# Altium schematic sheet ESP32_FLASH_CARD_READER.SchDoc
size 381 x 381 mm; SheetNumber: 1; SheetTotal: 2
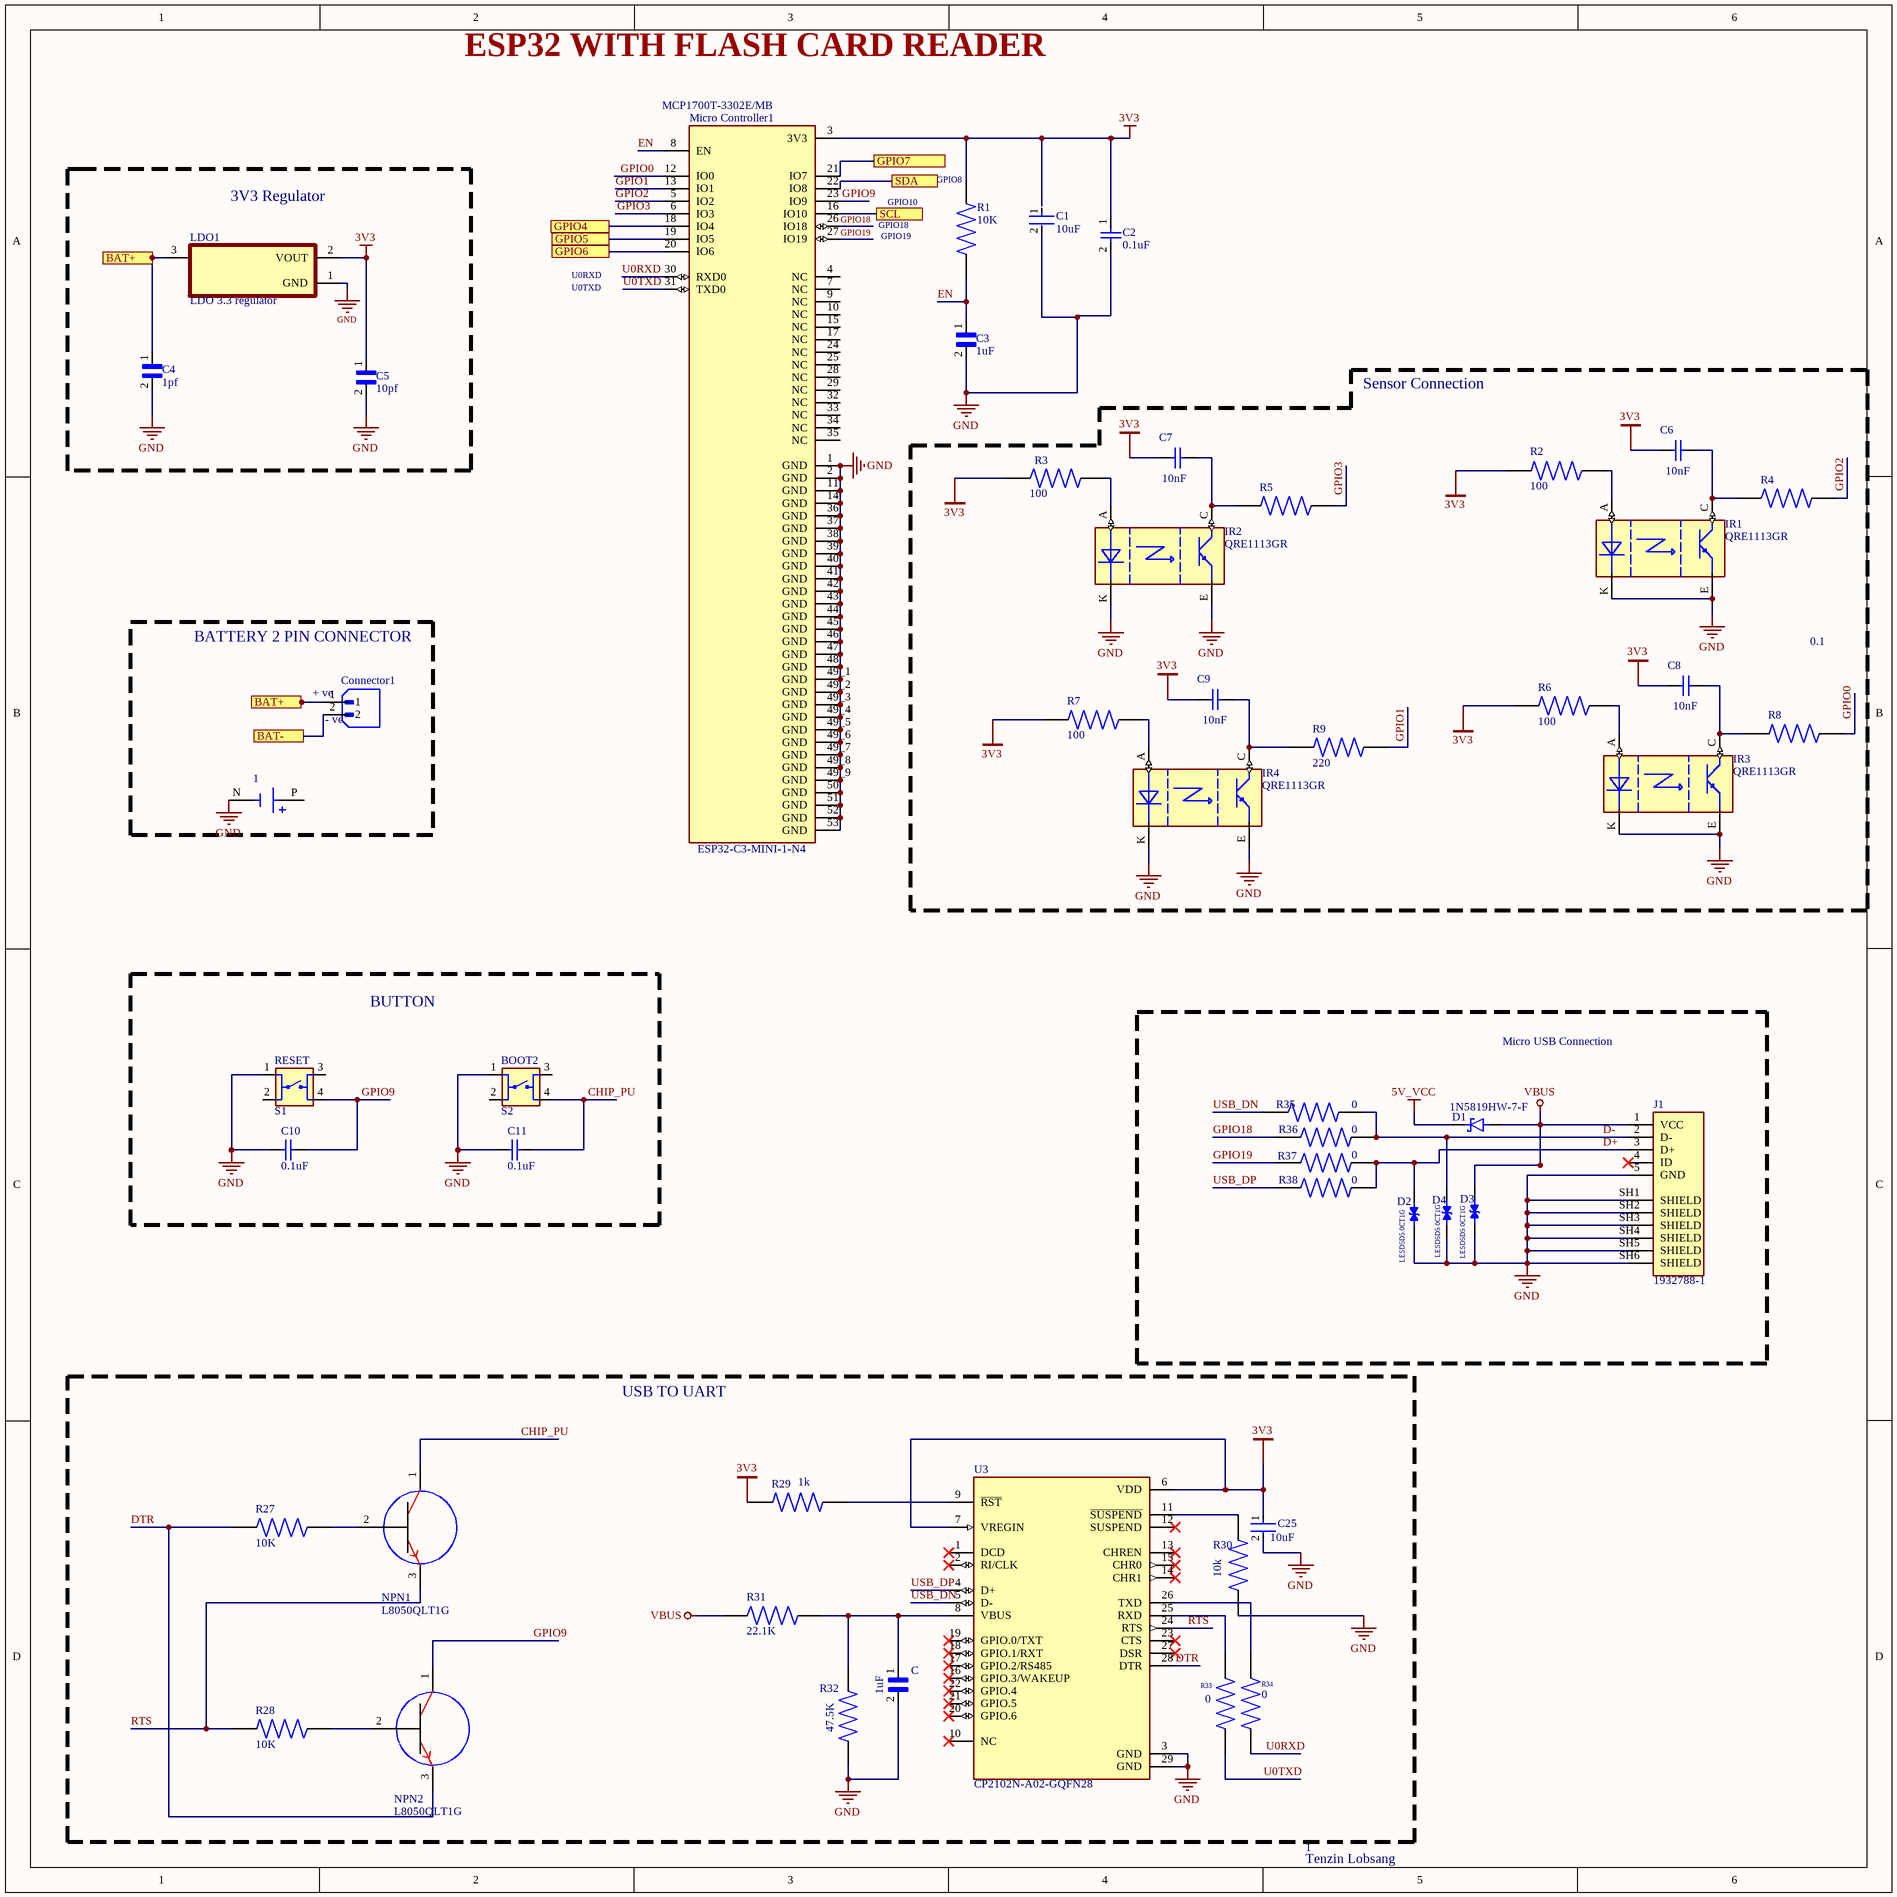
[diagram p0: ESP32_FLASH_CARD_READER.SchDoc]

## Parts
1  (no value)  [BAT_1043]
BOOT2  S2  [SW_4-1437565-2]
C  1uF  [CAPC1608X90N]
C1  10uF  [CAPC2012X88N]
C2  0.1uF  [CAPC1608X90X35NL10T15]
C3  1uF  [CAPC1608X90N]
C4  1pf  [CAPC2012X88N]
C5  10pf  [CAPC2012X88N]
C6  10nF  [WCAP-CSGP_0805_L2W1.25H1.25]
C7  10nF  [WCAP-CSGP_0805_L2W1.25H1.25]
C8  10nF  [WCAP-CSGP_0805_L2W1.25H1.25]
C9  10nF  [WCAP-CSGP_0805_L2W1.25H1.25]
C10  0.1uF  [CAPC1608X90X35NL10T15]
C11  0.1uF  [CAPC1608X90X35NL10T15]
C25  10uF  [CAPC2012X88N]
Connector1  B2B-XH-A  [JST_B2B-XH-A]  (value not drawn)
D1  1N5819HW-7-F  [SOD3715X145N]
D2  LESD5D5.0CT1G  [TVS_LESD5D5.0CT1G]
D3  LESD5D5.0CT1G  [TVS_LESD5D5.0CT1G]
D4  LESD5D5.0CT1G  [TVS_LESD5D5.0CT1G]
IR1  QRE1113GR  [4LEADSMD]
IR2  QRE1113GR  [4LEADSMD]
IR3  QRE1113GR  [4LEADSMD]
IR4  QRE1113GR  [4LEADSMD]
J1  1932788-1  [TE_1932788-1]
LDO1  LDO 3.3 regulator  [SOT95P237X112-3N]
Micro_Controller1  ESP32-C3-MINI-1-N4  Supplier Part Number 1: MCP1700T-3302E/MB  [XCVR_ESP32-C3-MINI-1-N4]
NPN1  L8050QLT1G  [SOT-23]
NPN2  L8050QLT1G  [SOT-23]
R1  10K  [RESC1005X40N]
R2  100  [RESC6432X75N]
R3  100  [RESC6432X75N]
R4  220  [RESC1005X35N]  (value not drawn)
R5  220  [RESC1005X35N]  (value not drawn)
R6  100  [RESC6432X75N]
R7  100  [RESC6432X75N]
R8  220  [RESC1005X35N]  (value not drawn)
R9  220  [RESC1005X35N]
R27  10K  [RESC1005X40N]
R28  10K  [RESC1005X40N]
R29  1k  [RES_ERJU06F1001V]
R30  10k  [RESC1005X40N]
R31  22.1K  [RES_ERJS02F2212X]
R32  47.5K  [RES_ERJU06F4752V]
R33  0  [RESC1608X55N]
R34  0  [RESC1608X55N]
R35  0  [RESC1608X55N]
R36  0  [RESC1608X55N]
R37  0  [RESC1608X55N]
R38  0  [RESC1608X55N]
RESET  S1  [SW_4-1437565-2]
U3  CP2102N-A02-GQFN28  [QFN50P500X500X80-29N]

## Blocks framed on the sheet
3V3 Regulator: C4 C5 LDO1
Sensor Connection: C6-C9 IR1-IR4 R2-R9
BATTERY 2 PIN CONNECTOR: 1 Connector1
BUTTON: BOOT2 C10 C11 RESET
Micro USB Connection: D1-D4 J1 R35-R38
USB TO UART: C C25 NPN1 NPN2 R27-R34 U3

## Ports
BAT+, BAT-, GPIO4, GPIO5, GPIO6, GPIO7, SCL, SDA

## Nets
3V3: C2.1 C5.1 C6.1 C7.1 C8.1 C9.1 C25.1 LDO1.2(VOUT) Micro_Controller1.3(3V3) R1.2 R2.1 R3.1 R6.1 R7.1 R29.1 U3.6(VDD) U3.7(VREGIN)
5V_VCC: D1.C(K)
GND: 1.N(NEG) BOOT2.1 C.2 C1.2 C2.2 C3.2 C4.2 C5.2 C10.1 C11.1 C25.2 D2.1 D3.2 D4.1 IR1.E IR1.K IR2.E IR2.K IR3.E IR3.K IR4.E IR4.K J1.5(GND) J1.SH1(SHIELD) J1.SH2(SHIELD) J1.SH3(SHIELD) J1.SH4(SHIELD) J1.SH5(SHIELD) J1.SH6(SHIELD) LDO1.1(GND) Micro_Controller1.1(GND) Micro_Controller1.2(GND) Micro_Controller1.11(GND) Micro_Controller1.14(GND) Micro_Controller1.36(GND) Micro_Controller1.37(GND) Micro_Controller1.38(GND) Micro_Controller1.39(GND) Micro_Controller1.40(GND) Micro_Controller1.41(GND) Micro_Controller1.42(GND) Micro_Controller1.43(GND) Micro_Controller1.44(GND) Micro_Controller1.45(GND) Micro_Controller1.46(GND) Micro_Controller1.47(GND) Micro_Controller1.48(GND) Micro_Controller1.49_1(GND) Micro_Controller1.49_2(GND) Micro_Controller1.49_3(GND) Micro_Controller1.49_4(GND) Micro_Controller1.49_5(GND) Micro_Controller1.49_6(GND) Micro_Controller1.49_7(GND) Micro_Controller1.49_8(GND) Micro_Controller1.49_9(GND) Micro_Controller1.50(GND) Micro_Controller1.51(GND) Micro_Controller1.52(GND) Micro_Controller1.53(GND) R30.1 R32.1 RESET.1 U3.3(GND) U3.29(GND)
VBUS: D1.A D3.1 J1.1(VCC) R31.1
BAT+: C4.1 Connector1.1 LDO1.3(VIN) ; port BAT+
BAT-: Connector1.2 ; port BAT-
CHIP_PU: BOOT2.4 C11.2 NPN1.1
D+: D2.2 J1.3(D+) R37.1 R38.1
D-: D4.2 J1.2(D-) R35.1 R36.1
DTR: R27.1 U3.28(DTR)
EN: C3.1 Micro_Controller1.8(EN) R1.1
GPIO0: Micro_Controller1.12(IO0) R8.2
GPIO1: Micro_Controller1.13(IO1) R9.2
GPIO2: Micro_Controller1.5(IO2) R4.2
GPIO3: Micro_Controller1.6(IO3) R5.2
GPIO4: Micro_Controller1.18(IO4) ; port GPIO4
GPIO5: Micro_Controller1.19(IO5) ; port GPIO5
GPIO6: Micro_Controller1.20(IO6) ; port GPIO6
GPIO7: Micro_Controller1.21(IO7) ; port GPIO7
GPIO9: C10.2 Micro_Controller1.23(IO9) NPN2.1 RESET.4
GPIO18: Micro_Controller1.26(IO18) R36.2
GPIO19: Micro_Controller1.27(IO19) R37.2
RTS: R28.1 U3.24(RTS)
SCL: Micro_Controller1.16(IO10) ; port SCL
SDA: Micro_Controller1.22(IO8) ; port SDA
U0RXD: Micro_Controller1.30(RXD0) R34.1
U0TXD: Micro_Controller1.31(TXD0) R33.1
USB_DN: R35.2 U3.5(D-)
USB_DP: R38.2 U3.4(D+)
NetC6_2: C6.2 IR1.C R4.1
NetC7_2: C7.2 IR2.C R5.1
NetC8_2: C8.2 IR3.C R8.1
NetC9_2: C9.2 IR4.C R9.1
NetC_1: C.1 R31.2 R32.2 U3.8(VBUS)
NetIR1_A: IR1.A R2.2
NetIR2_A: IR2.A R3.2
NetIR3_A: IR3.A R6.2
NetIR4_A: IR4.A R7.2
NetNPN1_2: NPN1.2 R27.2
NetNPN2_2: NPN2.2 R28.2
NetR29_2: R29.2 U3.9(~{RST})
NetR30_2: R30.2 U3.11(~{SUSPEND})
NetR33_2: R33.2 U3.25(RXD)
NetR34_2: R34.2 U3.26(TXD)

Not connected (* = marked no-connect by the designer): 1 P(POS); BOOT2 2 3; C1 1; J1 4(ID)*; Micro_Controller1 4(NC) 7(NC) 9(NC) 10(NC) 15(NC) 17(NC) 24(NC) 25(NC) 28(NC) 29(NC) 32(NC) 33(NC) 34(NC) 35(NC); NPN1 3; NPN2 3; RESET 2 3; U3 1(DCD)* 2(RI/CLK)* 10(NC)* 12(SUSPEND)* 13(CHREN)* 14(CHR1)* 15(CHR0)* 16(GPIO.3/WAKEUP)* 17(GPIO.2/RS485)* 18(GPIO.1/RXT)* 19(GPIO.0/TXT)* 20(GPIO.6)* 21(GPIO.5)* 22(GPIO.4)* 23(CTS)* 27(DSR)*

## Notes on the sheet
- ESP32 WITH FLASH CARD READER
- GPIO10
- (near R1) GPIO8
- U0RXD
- GPIO18
- GPIO19
- U0TXD
- 0.1
- (near Connector1) + ve
- (near Connector1) - ve
- 1
- Tenzin Lobsang

## Library data of the parts
1 = 1043: Price: None; Availability: Unavailable; Value: *; MP: 1043; Package: None
BOOT2 RESET = 4-1437565-2: Switch Tactile OFF (ON) SPST Round Button Gull Wing 0.05A 12VDC 1.57N SMD T/R; Availability: Unavailable; Package: None; MP: 4-1437565-2; Value: *; Price: None
C C3 = CL10B105KO8NNNC: 1ÂµF Â±10% 16V Ceramic Capacitor X7R 0603 (1608 Metric); MF: Samsung Electro-Mechanics; Digi-Key_Part_Number: 1276-1019-1-ND; Arrow_Electronics-Purchase-URL: https://snapeda.com/shop?store=Arrow+Electronics&id=3597999; Package: 0603 Samsung; DigiKey-Purchase-URL: https://snapeda.com/shop?store=DigiKey&id=3597999; SnapEDA_Link: https://www.snapeda.com/parts/CL10B105KO8NNNC/Samsung%20Electro-Mechanics/view-part/3597999/?ref=snap; MP: CL10B105KO8NNNC; Value: *
  C3: BuyPart: https://www.snapeda.com/parts/CL10B105KO8NNNC/Samsung%20Electro-Mechanics/view-part/3597999/?ref=eda
C1 C25 = CMP-13271-004224-1: Cap Ceramic 10uF 25V X5R ±20% Pad SMD 0603 +85°C T/R; Width: 0.031inch; Voltage Rating: 25V; Length: 0.063inch; Case Code (Metric): 1608; Dielectric: X5R; Termination: Wraparound; Capacitance: 10uF; Lead Free: Lead Free; Mount: Surface Mount; Package Quantity: 1; Case Code (Imperial): 0603; Thickness: 0.035inch; Packaging: Tape and Reel; Contact Plating: Tin; Min Operating Temperature: -55°C; Tolerance: 20%; Max Operating Temperature: 85°C; Case/Package: 0603
C2 C10 C11 = CMP-2100-03643-1: Chip Capacitor, 0.1 uF, +/- 10%, 50 V, -55 to 125 degC, 0603 (1608 Metric), RoHS, Tape and Reel; Manufacturer: Murata; Dielectric Material: Ceramic; Voltage Rating: 50V; Capacitance: 100nF; Dielectric: X7R; Insulation Resistance: 10GR; Case Code (Metric): 1608; Lead Free: LeadFree; Depth: 0.8mm; Number of Pins: 2; Radiation Hardening: No; Case/Package: 0603; Manufacturer URL: http://www.murata.com/; Packaging: TapeandReel; Length: 1.6mm; Contact Plating: Tin; Datasheet URL: http://psearch.en.murata.com/capacitor/product/GRM188R71H104KA93%23.pdf; Tolerance: 10%; Case Code (Imperial): 0603; Min Operating Temperature: -55degC; RoHSCompliant: true; Voltage: 50V; Termination: SMD/SMT; Mount: SurfaceMount; Material: Ceramic; Package Quantity: 1; Height: 0.8mm; Thickness: 0.035inch; REACH SVHC: NoSVHC; Max Operating Temperature: 125degC; Width: 0.8mm; Package Reference: 0603; Voltage Rating (DC): 50V; Datasheet Version: 42675.0; Package Description: 2-Pin Surface Mount Device, Body 1.6 x 0.8 mm
C4 C5 = C0805C100K5RAC7800: Package: None; Price: None; Value: *; MP: C0805C100K5RAC7800; Availability: Unavailable
C6-C9 = 885012007009: WCAP-CSGP Multilayer Ceramic Chip Capacitor, General Purpose, size 0805, NP0, 10nF, 10V; Manufacturer: Wurth Elektronik; Case/Size Code: 0805; Capacitance Tolerance: +/-5%; Insulation Resistance: 10GΩ; Q Factor: 1000; Technical Reference: NP00805103J010DFCT10000; Manufacturer Part Number: 885012007009; Category: Multilayer Ceramic Chip Capacitors; Match Code: WCAP-CSGP; ComponentLink1Description: Website Link; ComponentLink1URL: https://www.we-online.com/redexpert/article/885012007009?ad; ComponentLink2Description: Datasheet Link; ComponentLink2URL: https://www.we-online.com/redexpert/spec/885012007009?ad; Mount: Surface Mount; Min Operating Temperature: -55°C; Max Operating Temperature: 125°C; Packaging: Tape and Reel; Length: 2mm; Width: 1.25mm; Height: 1.25mm; Capacitance: 10nF; Ceramic Type: NP0; Rated Voltage (DC): 10V
Connector1 = B2B-XH-A: MF: {'manufacturer': u'JST Sales America Inc.'}; Package: None; Price: None; Value: *; MP: B2B-XH-A; Availability: Unavailable
D1 = 1N5819HW-7-F: Diode Schottky 40 V 1A Surface Mount SOD-123; MF: Diodes Inc.; Value: *; SnapEDA_Link: https://www.snapeda.com/parts/1N5819HW-7-F/Diodes+Inc./view-part/?ref=snap; Purchase-URL: https://pricing.snapeda.com/search/part/1N5819HW-7-F/?ref=eda; Availability: In Stock; Price: None; Package: SOD-123 Fairchild Semiconductor; Check_prices: https://www.snapeda.com/parts/1N5819HW-7-F/Diodes+Inc./view-part/?ref=eda; MP: 1N5819HW-7-F
D2-D4 = LESD5D5.0CT1G: Transient Voltage Suppressors for ESD Protection; MF: Leshan Radio Co.; Check_prices: https://www.snapeda.com/parts/LESD5D5.0CT1G/Leshan+Radio+Co./view-part/?ref=eda; Value: *; Availability: Not in stock; Package: None; SnapEDA_Link: https://www.snapeda.com/parts/LESD5D5.0CT1G/Leshan+Radio+Co./view-part/?ref=snap; MP: LESD5D5.0CT1G; Price: None
IR1-IR4 = QRE1113GR: Optical Switches, Reflective, Phototransistor Output Reflective Sensor; MF: SparkFun; SnapEDA_Link: https://www.snapeda.com/parts/QRE1113/SparkFun/view-part/?ref=snap; Package: None; Value: *; MP: QRE1113; Check_prices: https://www.snapeda.com/parts/QRE1113/SparkFun/view-part/?ref=eda
LDO1 = MCP1700T-3002E/TT: 25V 10uF X5R ±20% 0603 Multilayer Ceramic Capacitors MLCC - SMD/SMT ROHS; Manufacturer: Samsung; Manufacturer Part Number: CL10A106MA8NRNC; MF: Microchip; SnapEDA_Link: https://www.snapeda.com/parts/MCP1700T-3002E/TT/Microchip/view-part/48518/?ref=snap; MP: MCP1700T-3002E/TT; Availability: Unavailable; Price: None; Value: *; Package: SOT-23 Microchip; Supplier 1: Avnet; RoHS: Yes; Category: Ceramic Capacitors; Stock 1: 9192000; Pricing 1: 4000=0.01575 (USD); Mount: Surface Mount; Case/Package: 0603; Case Code (Metric): 1608; Case Code (Imperial): 0603; Material: Ceramic; Min Operating Temperature: -55°C; Max Operating Temperature: 85°C; Packaging: Cut Tape; Capacitance: 10uF; Tolerance: 20%; Voltage Rating: 25V; Series: CL; Height: 900um; Lead Free: Lead Free; RoHS Compliant: Yes; ComponentLink1URL: https://datasheet.ciiva.com/25766/cl10a106ma8nrnc-25766562.pdf?src-supplier=Digikey; ComponentLink1Description: https://datasheet.ciiva.com/25766/cl10a106ma8nrnc-25766562.pdf?src-supplier=Digikey
Micro_Controller1 = ESP32-C3-MINI-1-N4: Pwr Sply Func, Voltage Regulator, LDO, SOT-89, PD 1.635W, VO 3.3V, Regline +/-0.75%/V; Manufacturer: Microchip; MF: Espressif Systems; Number of Outputs: 1; Min Input Voltage: 2.3V; Max Output Current: 250mA; Dropout Voltage: 178mV; Max Input Voltage: 6V; Input Bias Current: 1.6uA; Polarity: Positive; Quiescent Current: 4uA; Accuracy: 3%; Output Type: Fixed; Output Voltage Accuracy: 2%; SnapEDA_Link: https://www.snapeda.com/parts/ESP32-C3-MINI-1-N4/Espressif+Systems/view-part/?ref=snap; Package: SMD-53 Espressif Systems; Value: *; MP: ESP32-C3-MINI-1-N4; Check_prices: https://www.snapeda.com/parts/ESP32-C3-MINI-1-N4/Espressif+Systems/view-part/?ref=eda; Supplier 1: Arrow Electronics; Manufacturer Part Number: MCP1700T-3302E/MB; RoHS: Yes; Category: Voltage Regulators - Linear; Stock 1: 650; Pricing 1: 1=0.4806, 10=0.4731, 25=0.4655, 100=0.458, 250=0.4505, 500=0.4429 (USD); Mount: Surface Mount; Case/Package: SOT-89; Number of Pins: 3; Min Operating Temperature: -40°C; Max Operating Temperature: 125°C; Packaging: Tape and Reel; Output Voltage: 3.3V; Output Current: 250mA; Nominal Output Voltage: 3.3V; Package Quantity: 1000; Max Power Dissipation: 1.635W; Min Output Voltage: 3.3V; Power Dissipation: 1.635W; Max Supply Voltage: 6V; Min Supply Voltage: 2.3V; Max Output Voltage: 3.3V; Termination: SMD/SMT; Supply Current: 4uA; Number of Channels: 1; Length: 4.6mm; Width: 2.29mm; Height: 1.6mm; Radiation Hardening: No; Reach SVHC Compliant: No; Lead Free: Lead Free; RoHS Compliant: Yes
R1 R27 R28 R30 = CRG0402J10K/10: CRG0402 chip resistor,10K 5% 0.063W | TE Connectivity CRG0402J10K/10; Power_Rating: .063 W; Voltage_Rating: 50 V; SnapEDA_Link: https://www.snapeda.com/parts/CRG0402J10K/10/TE+Connectivity+Passive+Product/view-part/?ref=snap; Package: 0402; Resistance: 10K; Value: *; MF: TE Connectivity; MP: CRG0402J10K/10; EU_RoHS_Compliance: Compliant with Exemptions; Tolerance: 5%; Check_prices: https://www.snapeda.com/parts/CRG0402J10K/10/TE+Connectivity+Passive+Product/view-part/?ref=eda
R2 R3 R6 R7 = CRS2512-FX-1000ELF: CRS Series Anti-surge Resistor 2512 Case 100Ohms 2W +/-100ppm/degC | Bourns CRS2512-FX-1000ELF; SnapEDA_Link: https://www.snapeda.com/parts/CRS2512-FX-1000ELF/Bourns/view-part/?ref=snap; Package: 6432 Bourns; Value: *; MF: Bourns; MP: CRS2512-FX-1000ELF; Check_prices: https://www.snapeda.com/parts/CRS2512-FX-1000ELF/Bourns/view-part/?ref=eda
R4 R5 R8 R9 = CPF0402B220RE1: Resistencia de pelÃ­cula delgada de precisiÃ³n SMD, carcasa 0402, 220 ohmios +/-0,1 %, 063 W +/-25 ppm/C ¦ TE Connectivity CPF0402B220RE1; Power_Rating: .063 W; Voltage_Rating: 25 V; Tolerance: .1%; SnapEDA_Link: https://www.snapeda.com/parts/CPF0402B220RE1/TE+Connectivity/view-part/?ref=snap; Package: 0402; Resistance: 220; Value: *; MF: TE Connectivity; MP: CPF0402B220RE1; EU_RoHS_Compliance: Compliant; Check_prices: https://www.snapeda.com/parts/CPF0402B220RE1/TE+Connectivity/view-part/?ref=eda
R29 = ERJU06F1001V: Res Thick Film 0805 1K Ohm 1% 0.125W(1/8W) Â±100ppm/C Sulfur Resistant Pad SMD Automotive T/R; MF: Panasonic; Availability: No availability data; Value: *; Check_prices: https://www.snapeda.com/parts/ERJU06F1001V/Panasonic/view-part/5742057/?ref=eda; Package: 2012-2 Panasonic; SnapEDA_Link: https://www.snapeda.com/parts/ERJU06F1001V/Panasonic/view-part/5742057/?ref=snap; Price: None; MP: ERJU06F1001V
R31 = ERJS02F2212X: Price: None; MP: ERJS02F2212X; Package: None; Value: *; Availability: Unavailable
R32 = ERJU06F4752V: Package: None; Price: None; MP: ERJU06F4752V; Availability: Unavailable; Value: *
R33-R38 = MC0603SAF0000T5E: Package: None; Value: *; Price: None; MP: MC0603SAF0000T5E; Availability: Unavailable
U3 = CP2102N-A02-GQFN28: USB Bridge, USB to UART USB 2.0 UART Interface 28-QFN (5x5); MF: Silicon Labs; Value: *; Price: None; Package: WFQFN-28 Silicon Labs; Check_prices: https://www.snapeda.com/parts/CP2102N-A02-GQFN28/Silicon+Labs/view-part/?ref=eda; Availability: In Stock; SnapEDA_Link: https://www.snapeda.com/parts/CP2102N-A02-GQFN28/Silicon+Labs/view-part/?ref=snap; Purchase-URL: https://pricing.snapeda.com/search/part/CP2102N-A02-GQFN28/?ref=eda; MP: CP2102N-A02-GQFN28
J1 = 1932788-1: Package: None; Price: None; Value: *; MP: 1932788-1; Availability: Unavailable